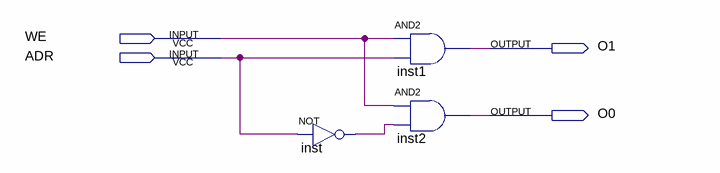
[diagram p0: schematic sheet]
// Quartus schematic Decoder1_2.bdf as structural Verilog: 3 symbols, 4 pins
module Decoder1_2 (
  input  WE,
  input  ADR,
  output O1,
  output O0
);

  wire inst_out;

  not inst (inst_out, ADR);
  and inst1 (O1, WE, ADR);
  and inst2 (O0, WE, inst_out);
endmodule
